# Altium schematic sheet AND_opertaions.SchDoc
size A4; SheetNumber: 4; SheetTotal: 5
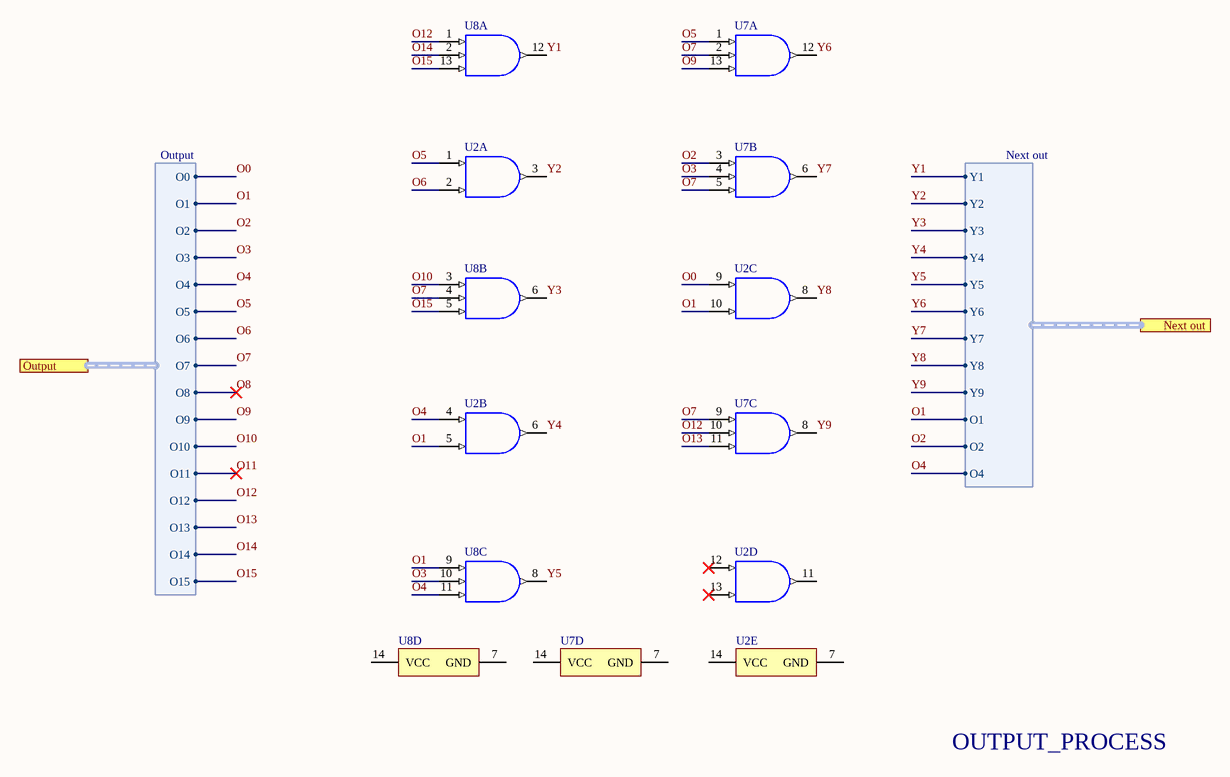
[diagram p0: AND_opertaions.SchDoc]

## Parts
U2  SN74S08N  [N0014A]  (value not drawn)  (parts A,B,C,D,E of 5)
U7  SN74LS11N  [N0014A]  (value not drawn)  (parts A,B,C,D of 4)
U8  SN74LS11N  [N0014A]  (value not drawn)  (parts A,B,C,D of 4)

## Ports
Next out (harness Next out, see Top[3C], Final out 1[1B]), Output (harness Output, see Top[2C], encode and decode 1[4B])

## Harnesses
Output: O0, O1, O10, O11, O12, O13, O14, O15, O2, O3, O4, O5, O6, O7, O8, O9
Next out: Y1, Y2, Y3, Y4, Y5, Y6, Y7, Y8, Y9, O1, O2, O4

## Nets
O0: U2.9(3A) ; port Output.O0
O1: U2.5(2B) U2.10(3B) U8.9(3A) ; port Output.O1, port Next out.O1
O2: U7.3(2A) ; port Output.O2, port Next out.O2
O3: U7.4(2B) U8.10(3B) ; port Output.O3
O4: U2.4(2A) U8.11(3C) ; port Output.O4, port Next out.O4
O5: U2.1(1A) U7.1(1A) ; port Output.O5
O6: U2.2(1B) ; port Output.O6
O7: U7.2(1B) U7.5(2C) U7.9(3A) U8.4(2B) ; port Output.O7
O8: port Output.O8
O9: U7.13(1C) ; port Output.O9
O10: U8.3(2A) ; port Output.O10
O11: port Output.O11
O12: U7.10(3B) U8.1(1A) ; port Output.O12
O13: U7.11(3C) ; port Output.O13
O14: U8.2(1B) ; port Output.O14
O15: U8.5(2C) U8.13(1C) ; port Output.O15
Y1: U8.12(1Y) ; port Next out.Y1
Y2: U2.3(1Y) ; port Next out.Y2
Y3: U8.6(2Y) ; port Next out.Y3
Y4: U2.6(2Y) ; port Next out.Y4
Y5: U8.8(3Y) ; port Next out.Y5
Y6: U7.12(1Y) ; port Next out.Y6
Y7: U7.6(2Y) ; port Next out.Y7
Y8: U2.8(3Y) ; port Next out.Y8
Y9: U7.8(3Y) ; port Next out.Y9

Not connected (* = marked no-connect by the designer): U2 7(GND) 11(4Y) 12(4A)* 13(4B)* 14(VCC); U7 7(GND) 14(VCC); U8 7(GND) 14(VCC)

## Notes on the sheet
- OUTPUT_PROCESS

## Library data of the parts
U2 = CMP-0777-00282-3: Quad 2-input positive-AND gates, N0014A, TUBE; Manufacturer: Texas Instruments; Output Drive (IOL/IOH)(Max)(mA): -24/24; Rating: Catalog; VCC(Min)(V): 4.75; Bits(#): 4; Input Type: TTL; Schmitt Trigger: No; tpd @ Nom Voltage(Max)(ns): 7.5; Technology Family: S; Voltage(Nom)(V): 5; VCC(Max)(V): 5.25; F @ Nom Voltage(Max)(Mhz): 50; ICC @ Nom Voltage(Max)(mA): 0.032; PackageReference: N0014A; DatasheetVersion: SDLS033; Operating Temperature Range(C): 0 to 70; Output Type: TTL; Generic Part Number: SN74S08
U7 U8 = CMP-0777-00254-3: Triple 3-input positive-AND gates, N0014A, TUBE; Manufacturer: Texas Instruments; Output Type: TTL; VCC(Min)(V): 4.75; Technology Family: LS; Bits(#): 3; Voltage(Nom)(V): 5; ICC @ Nom Voltage(Max)(mA): 0.0036; Rating: Catalog; VCC(Max)(V): 5.25; tpd @ Nom Voltage(Max)(ns): 15; Output Drive (IOL/IOH)(Max)(mA): 0/8; F @ Nom Voltage(Max)(Mhz): 35; Schmitt Trigger: No; Input Type: TTL; DatasheetVersion: SDLS131; PackageReference: N0014A; Operating Temperature Range(C): 0 to 70; Generic Part Number: SN74LS11